# Altium schematic sheet CPU.SchDoc
size A4
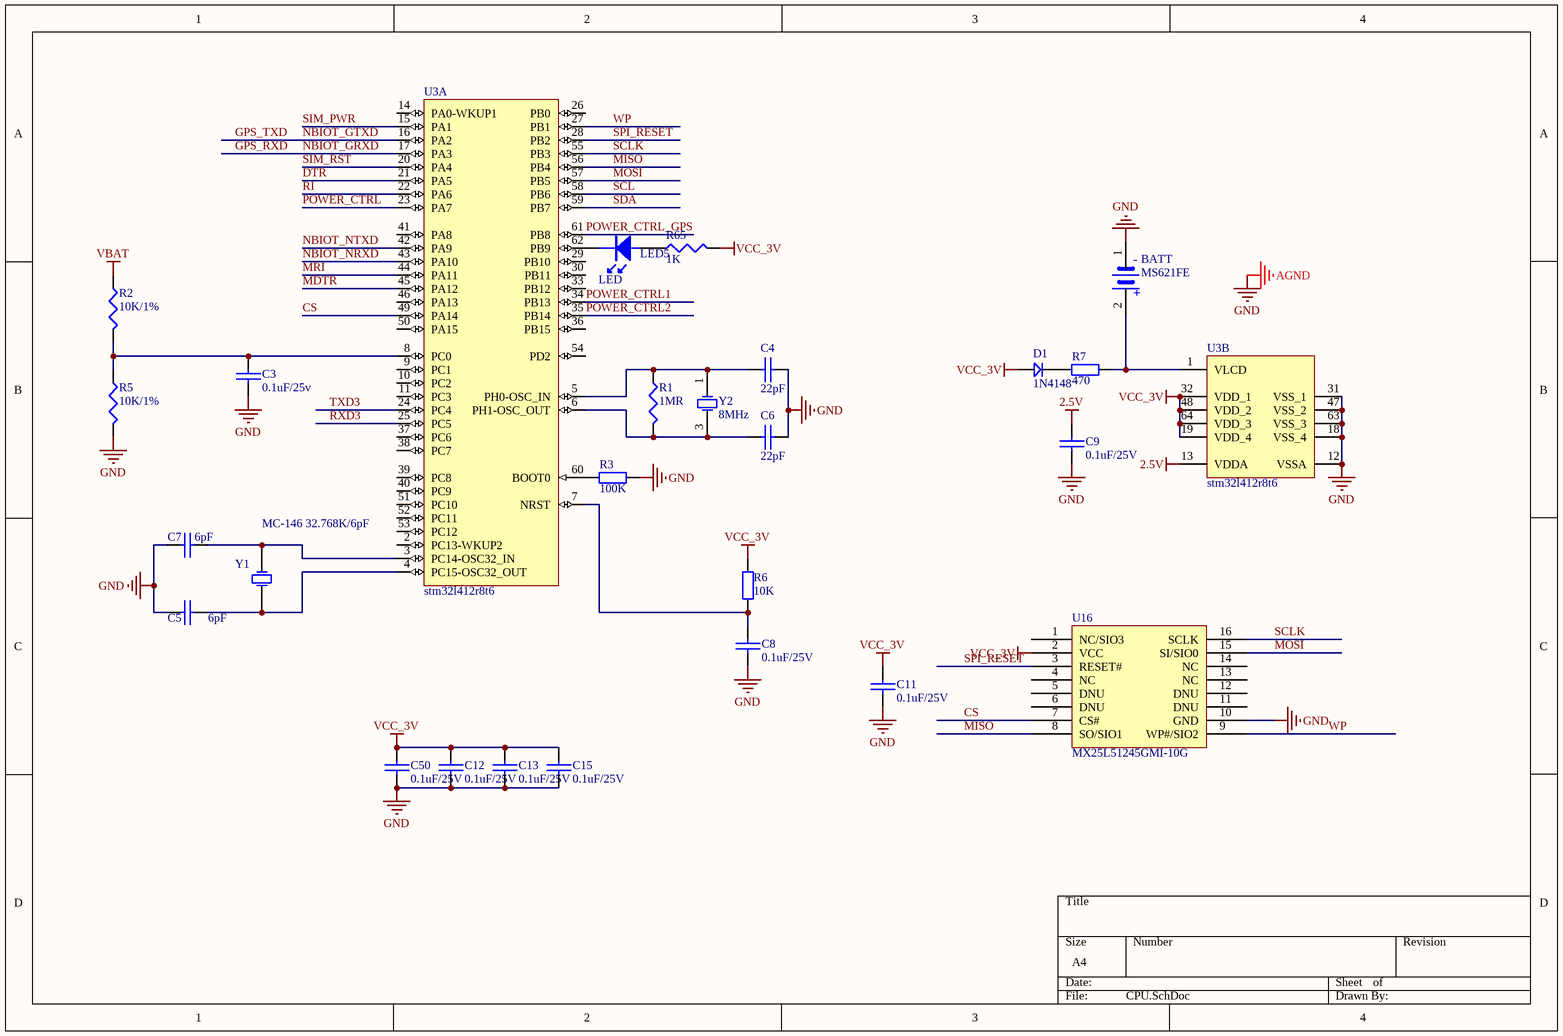
[diagram p0: CPU.SchDoc]

## Parts
BATT  MS621FE  [MS621FE]
C3  0.1uF/25v  [0402c]
C4  22pF  [0402c]
C5  6pF  [0402c]
C6  22pF  [0402c]
C7  6pF  [0402c]
C8  0.1uF/25V  [0402C]
C9  0.1uF/25V  [0402C]
C11  0.1uF/25V  [0402C]
C12  0.1uF/25V  [0402C]
C13  0.1uF/25V  [0402C]
C15  0.1uF/25V  [0402C]
C50  0.1uF/25V  [0402C]
D1  1N4148  [DIODE_SOP]
LED5  LED  [0603LED]
R1  1MR  [0402R]
R2  10K/1%  [0402R]
R3  100K  [0402R]
R5  10K/1%  [0402R]
R6  10K  [0402R]
R7  470  [0402R]
R65  1K  [0402R]
U3  stm32l412r8t6  [LQFP-64]  (parts A,B of 2)
U16  MX25L51245GMI-10G  [SOP127P1030X239-16N]
Y1  MC-146 32.768K/6pF  [32.768K]
Y2  8MHz  [OSCILLATOR-3.2X2.5]

## Nets
2.5V: C9.2 U3.13(VDDA)
AGND: BATT.1 C3.2 C4.1 C5.2 C6.1 C7.2 C8.1 C9.1 C11.1 C12.1 C13.1 C15.1 C50.1 R3.2 R5.2 U3.12(VSSA) U3.18(VSS_4) U3.31(VSS_1) U3.47(VSS_2) U3.63(VSS_3) U16.10(GND)  [also labelled GND]
VBAT: R2.1
VCC_3V: C11.2 C12.2 C13.2 C15.2 C50.2 D1.1 R6.1 R65.2 U3.19(VDD_4) U3.32(VDD_1) U3.48(VDD_2) U3.64(VDD_3) U16.2(VCC)
CS: U3.49(PA14) U16.7(CS#)
DTR: U3.21(PA5)
GPS_RXD: U3.17(PA3)  [also labelled NBIOT_GRXD]
GPS_TXD: U3.16(PA2)  [also labelled NBIOT_GTXD]
MDTR: U3.45(PA12)
MISO: U3.56(PB4) U16.8(SO/SIO1)
MOSI: U3.57(PB5) U16.15(SI/SIO0)
MRI: U3.44(PA11)
NBIOT_NRXD: U3.43(PA10)
NBIOT_NTXD: U3.42(PA9)
POWER_CTRL: U3.23(PA7)
POWER_CTRL1: U3.34(PB13)
POWER_CTRL2: U3.35(PB14)
POWER_CTRL_GPS: U3.61(PB8)
RI: U3.22(PA6)
RXD3: U3.25(PC5)
SCL: U3.58(PB6)
SCLK: U3.55(PB3) U16.16(SCLK)
SDA: U3.59(PB7)
SIM_PWR: U3.15(PA1)
SIM_RST: U3.20(PA4)
SPI_RESET: U3.28(PB2) U16.3(RESET#)
TXD3: U3.24(PC4)
WP: U3.27(PB1) U16.9(WP#/SIO2)
NetBATT_2: BATT.2 R7.2 U3.1(VLCD)
NetC3_1: C3.1 R2.2 R5.1 U3.8(PC0)
NetC4_2: C4.2 R1.1 U3.5(PH0-OSC_IN) Y2.1(OSC1)
NetC5_1: C5.1 U3.4(PC15-OSC32_OUT) Y1.2(OSC2)
NetC6_2: C6.2 R1.2 U3.6(PH1-OSC_OUT) Y2.3(OSC2)
NetC7_1: C7.1 U3.3(PC14-OSC32_IN) Y1.1(OSC1)
NetC8_2: C8.2 R6.2 U3.7(NRST)
NetD1_2: D1.2 R7.1
NetLED5_1: LED5.1 R65.1
NetLED5_2: LED5.2 U3.62(PB9)
NetR3_1: R3.1 U3.60(BOOT0)

Not connected (* = marked no-connect by the designer): U3 2(PC13-WKUP2) 9(PC1) 10(PC2) 11(PC3) 14(PA0-WKUP1) 26(PB0) 29(PB10) 30(PB11) 33(PB12) 36(PB15) 37(PC6) 38(PC7) 39(PC8) 40(PC9) 41(PA8) 46(PA13) 50(PA15) 51(PC10) 52(PC11) 53(PC12) 54(PD2); U16 1(NC/SIO3) 4(NC) 5(DNU) 6(DNU) 11(DNU) 12(DNU) 13(NC) 14(NC)

## Notes on the sheet
- (in symbol SBatery) -; +

## Library data of the parts
BATT = SBatery
C3-C9 C11-C13 C15 C50 = CAP: Capacitor
D1 = D
R1 = Res3: Resistor; Published: 8-Jun-2000; LatestRevisionDate: 29-May-2009; LatestRevisionNote: IPC-7351 Footprint Added.; PackageReference: J1-0603; Publisher: Altium Limited; PackageDescription: Chip Resistor
R2 R5 R65 = RES1: P: 1/8W
R3 R6 R7 = Res2: Resistor; Value: 1K; Published: 8-Jun-2000; LatestRevisionDate: 17-Jul-2002; LatestRevisionNote: Re-released for DXP Platform.; PackageReference: AXIAL-0.4; Publisher: Altium Limited
U3 = STM32L100R8T6: ARM Cortex-M3 32-bit MCU, 64 KB Flash, 8 KB Internal RAM, 51 I/Os, 64-pin LQFP, -40 to 85 degC, Tray; Manufacturer: STMicroelectronics; D/A Converter: 2x12-bit (2 Channel); Data E2PROM nom (B): 2048; Display controller: LCD 4x32/8x28; FLASH Size (Prog) (kB): 64; I/Os (High Current): 51; Internal RAM Size (kB): 8; Operating Frequency(F) (Processor speed) (MHz): 32; Supply Voltage(Vcc) min (V): 1.8; DatasheetVersion: Rev. 1; PackageVersion: Rev. 4, 06/2013; PackageReference: LQFP64; PackageDescription: 64-Pin Low Profile Quad Flat Package, 10 x 10 mm Body, 0.5 mm Pitch; Core: ARM Cortex-M3; Packing: Tray; Mounting Technology: Surface Mount; PartNumber: STM32L100R8T6; ComponentLink1Description: Manufacturer URL; ComponentLink1URL: http://www.st.com/web/en/home.html; ComponentLink2Description: Datasheet; ComponentLink2URL: http://www.st.com/st-web-ui/static/active/en/resource/technical/document/datasheet/DM00078075.pdf; ComponentLink3Description: Package Specification; ComponentLink3URL: http://www.st.com/st-web-ui/static/active/en/resource/technical/document/datasheet/DM00037051.pdf
Y1 Y2 = XTAL: Crystal Oscillator; Published: 8-Jun-2000; LatestRevisionDate: 17-Jul-2002; LatestRevisionNote: Re-released for DXP Platform.; PackageReference: R38; Publisher: Altium Limited
  Y2: PackageDescription: Crystal, Thru-Hole; 2 Leads; Body 3.1 x 8.2 mm (Dia.xH)